# Altium schematic sheet EMMC.SchDoc
size A3; SheetNumber: 7; SheetTotal: 14
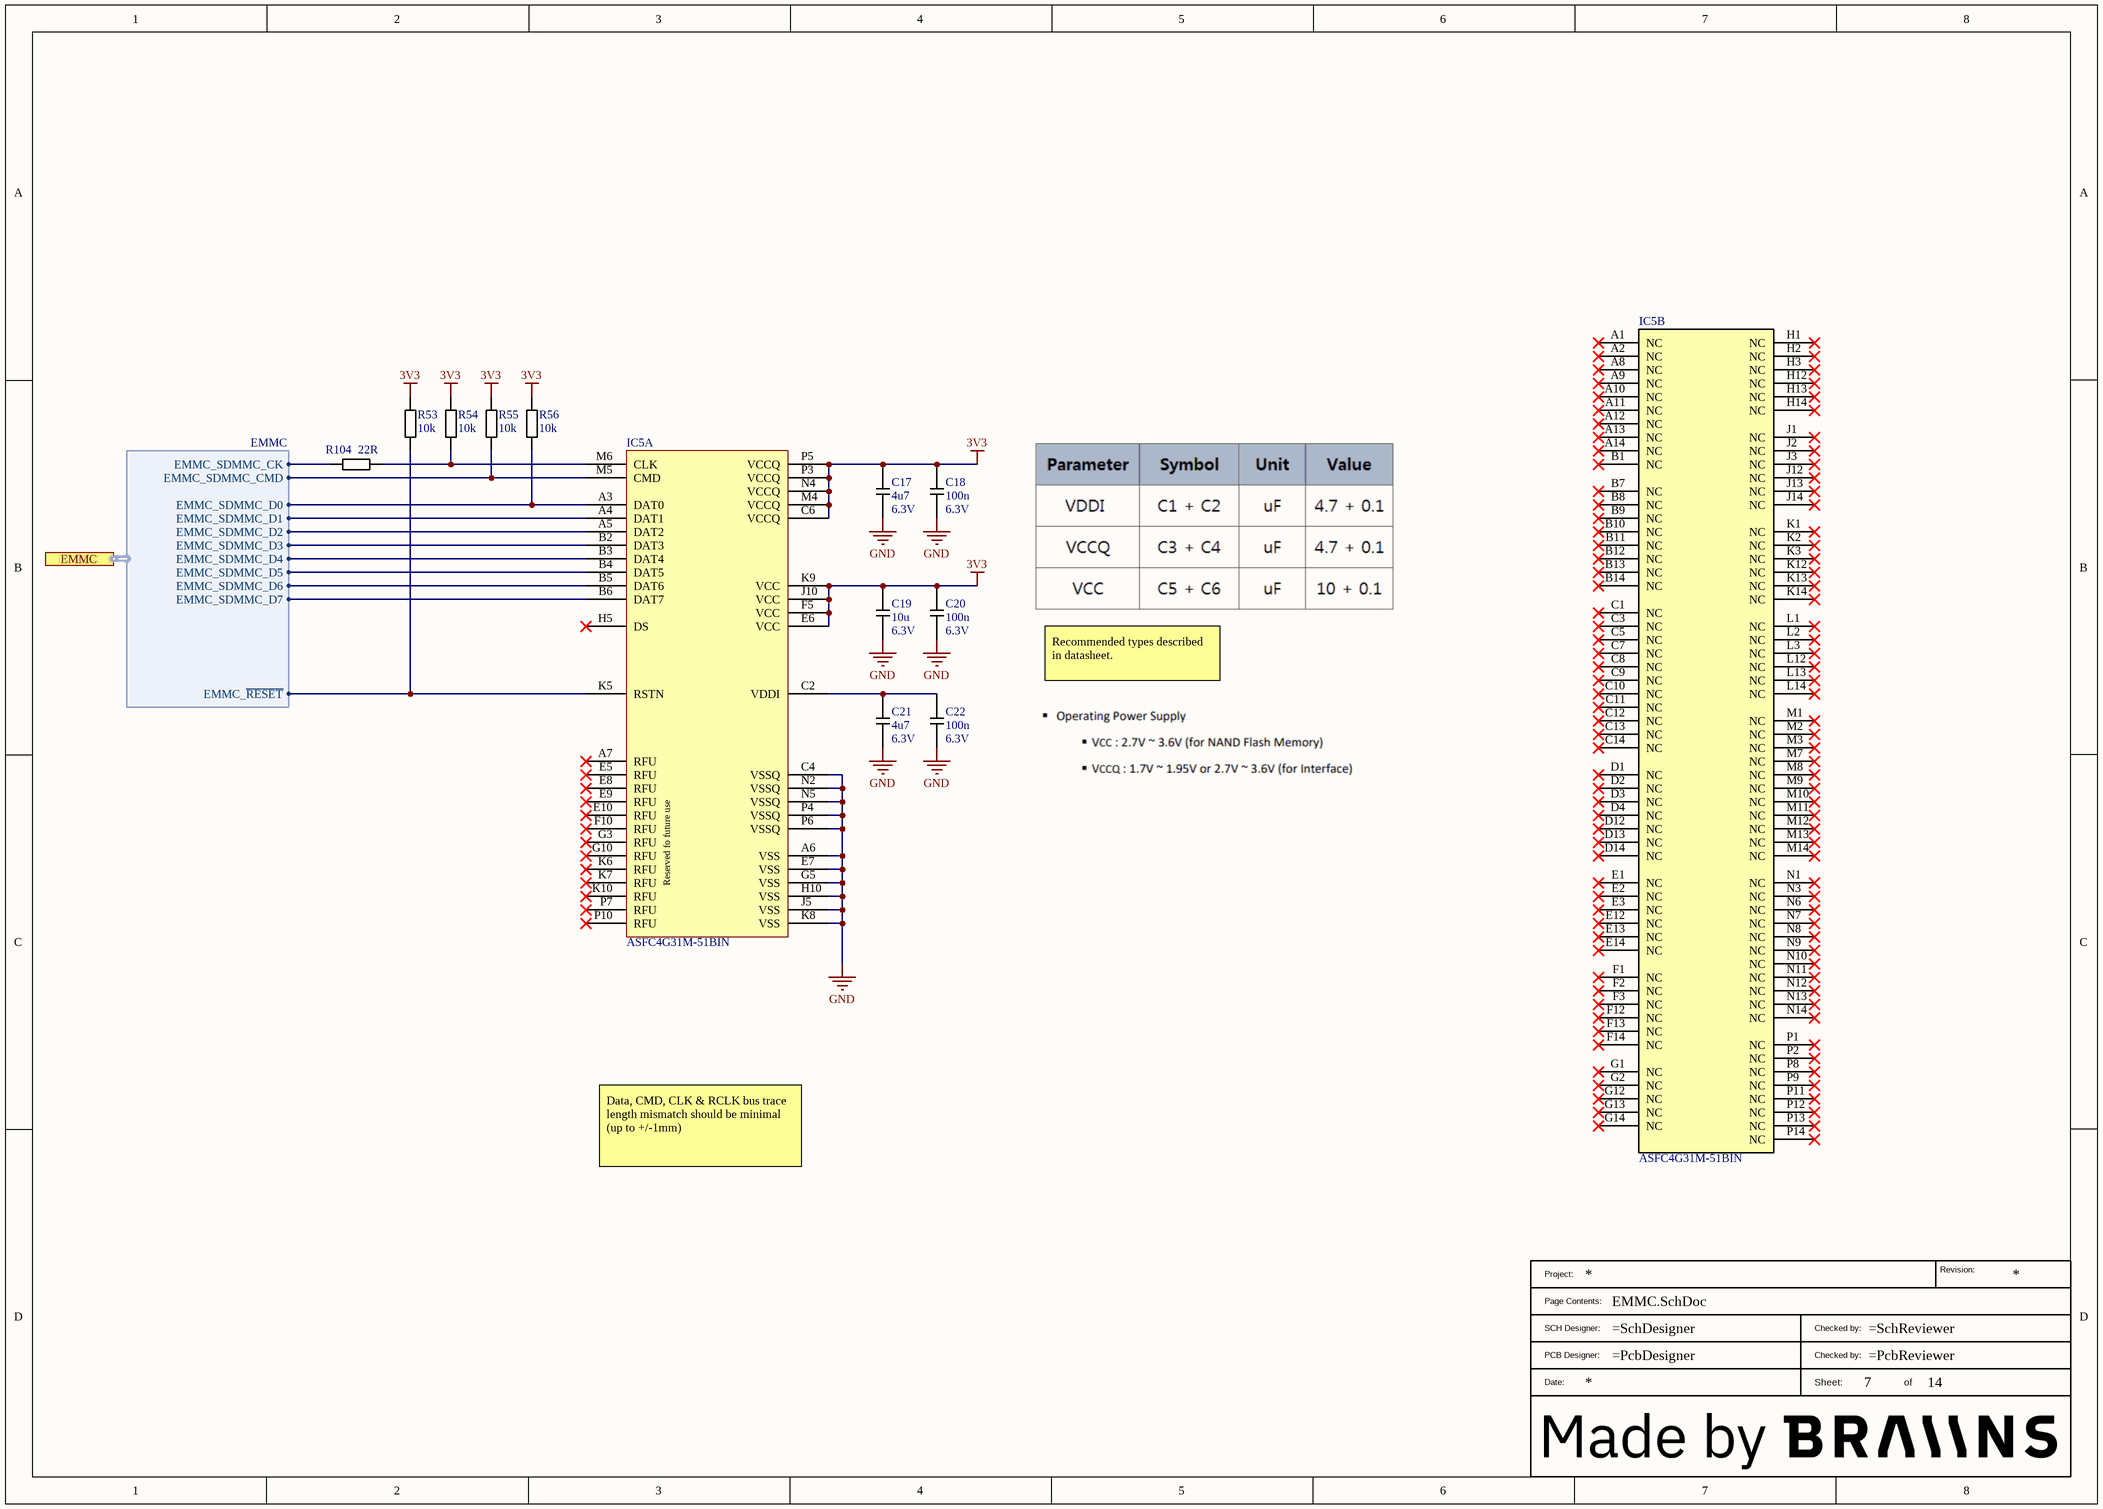
[diagram p0: EMMC.SchDoc]

## Parts
?  BraiinsTitleBlockWithLogo  (value not drawn)  (graphical)
C17  Voltage_Rating: 6.3V  [CAP0805]  (hidden comment: 4u7)
C18  Voltage_Rating: 6.3V  [CAP0603]  (hidden comment: 100n)
C19  Voltage_Rating: 6.3V  [CAP0805]  (hidden comment: 10u)
C20  Voltage_Rating: 6.3V  [CAP0603]  (hidden comment: 100n)
C21  Voltage_Rating: 6.3V  [CAP0805]  (hidden comment: 4u7)
C22  Voltage_Rating: 6.3V  [CAP0603]  (hidden comment: 100n)
IC5  ASFC4G31M-51BIN  [BGA153C50P14X14_1150X1300X100]  (parts A,B of 2)
R53  10k  [RES0402]
R54  10k  [RES0402]
R55  10k  [RES0402]
R56  10k  [RES0402]
R104  22R  [RES0402]

## Ports
EMMC (harness EMMC)

## Harnesses
EMMC: EMMC_SDMMC_CK, EMMC_SDMMC_CMD, EMMC_SDMMC_D0, EMMC_SDMMC_D1, EMMC_SDMMC_D2, EMMC_SDMMC_D3, EMMC_SDMMC_D4, EMMC_SDMMC_D5, EMMC_SDMMC_D6, EMMC_SDMMC_D7, EMMC_~{RESET}

## Nets
3V3: C17.1 C18.1 C19.1 C20.1 IC5.C6(VCCQ) IC5.E6(VCC) IC5.F5(VCC) IC5.J10(VCC) IC5.K9(VCC) IC5.M4(VCCQ) IC5.N4(VCCQ) IC5.P3(VCCQ) IC5.P5(VCCQ) R53.1 R54.1 R55.1 R56.1
GND: C17.2 C18.2 C19.2 C20.2 C21.2 C22.2 IC5.A6(VSS) IC5.C4(VSSQ) IC5.E7(VSS) IC5.G5(VSS) IC5.H10(VSS) IC5.J5(VSS) IC5.K8(VSS) IC5.N2(VSSQ) IC5.N5(VSSQ) IC5.P4(VSSQ) IC5.P6(VSSQ)
NetC21_1: C21.1 C22.1 IC5.C2(VDDI)
NetIC5_A3: IC5.A3(DAT0) R56.2 ; port EMMC.EMMC_SDMMC_D0
NetIC5_A4: IC5.A4(DAT1) ; port EMMC.EMMC_SDMMC_D1
NetIC5_A5: IC5.A5(DAT2) ; port EMMC.EMMC_SDMMC_D2
NetIC5_B2: IC5.B2(DAT3) ; port EMMC.EMMC_SDMMC_D3
NetIC5_B3: IC5.B3(DAT4) ; port EMMC.EMMC_SDMMC_D4
NetIC5_B4: IC5.B4(DAT5) ; port EMMC.EMMC_SDMMC_D5
NetIC5_B5: IC5.B5(DAT6) ; port EMMC.EMMC_SDMMC_D6
NetIC5_B6: IC5.B6(DAT7) ; port EMMC.EMMC_SDMMC_D7
NetIC5_K5: IC5.K5(RSTN) R53.2 ; port EMMC.EMMC_~{RESET}
NetIC5_M5: IC5.M5(CMD) R55.2 ; port EMMC.EMMC_SDMMC_CMD
NetIC5_M6: IC5.M6(CLK) R54.2 R104.2
NetR104_1: R104.1 ; port EMMC.EMMC_SDMMC_CK

Not connected (* = marked no-connect by the designer): IC5 A1(NC)* A2(NC)* A7(RFU)* A8(NC)* A9(NC)* A10(NC)* A11(NC)* A12(NC)* A13(NC)* A14(NC)* B1(NC)* B7(NC)* B8(NC)* B9(NC)* B10(NC)* B11(NC)* B12(NC)* B13(NC)* B14(NC)* C1(NC)* C3(NC)* C5(NC)* C7(NC)* C8(NC)* C9(NC)* C10(NC)* C11(NC)* C12(NC)* C13(NC)* C14(NC)* D1(NC)* D2(NC)* D3(NC)* D4(NC)* D12(NC)* D13(NC)* D14(NC)* E1(NC)* E2(NC)* E3(NC)* E5(RFU)* E8(RFU)* E9(RFU)* E10(RFU)* E12(NC)* E13(NC)* E14(NC)* F1(NC)* F2(NC)* F3(NC)* F10(RFU)* F12(NC)* F13(NC)* F14(NC)* G1(NC)* G2(NC)* G3(RFU)* G10(RFU)* G12(NC)* G13(NC)* G14(NC)* H1(NC)* H2(NC)* H3(NC)* H5(DS)* H12(NC)* H13(NC)* H14(NC)* J1(NC)* J2(NC)* J3(NC)* J12(NC)* J13(NC)* J14(NC)* K1(NC)* K2(NC)* K3(NC)* K6(RFU)* K7(RFU)* K10(RFU)* K12(NC)* K13(NC)* K14(NC)* L1(NC)* L2(NC)* L3(NC)* L12(NC)* L13(NC)* L14(NC)* M1(NC)* M2(NC)* M3(NC)* M7(NC)* M8(NC)* M9(NC)* M10(NC)* M11(NC)* M12(NC)* M13(NC)* M14(NC)* N1(NC)* N3(NC)* N6(NC)* N7(NC)* N8(NC)* N9(NC)* N10(NC)* N11(NC)* N12(NC)* N13(NC)* N14(NC)* P1(NC)* P2(NC)* P7(RFU)* P8(NC)* P9(NC)* P10(RFU)* P11(NC)* P12(NC)* P13(NC)* P14(NC)*

## Notes on the sheet
- Recommended types described in datasheet.
- Data, CMD, CLK & RCLK bus trace length mismatch should be minimal (up to +/-1mm)
- (in symbol 30134, part A) Reserved fo future use
- (in symbol BraiinsTitleBlockWithLogo) Revision:; Project:; Page Contents:; SCH Designer:; Checked by:; PCB Designer:; Date:; Sheet:; of

## Library data of the parts
C17 C21 = 30175: CAP CER 4u7 10% 6.3V X7R 0805; Part_Type: Capacitor; Part_Status: New; ID: 30175; Updated By: janjuranek; Sorted_Value: 4; Value: 4u7; Sub_Type: CER; Manufacturer Part Description: CAP CER 4u7 10% 6.3V X7R 0805; Package_Case: 0805; RoHS: Yes; Dielectric: X7R; Tolerance: 10%; Created By: janjuranek; Created_Date: 2023-05-09 02:30:59; Updated_Date: 2023-05-09 02:31:25; ComponentLink1Description: Datasheet; ComponentLink2Description: Supplier Part Details
C18 C20 C22 = 30140: CAP CER 100n 10% 6.3V X7R 0603; Part_Type: Capacitor; Part_Status: New; ID: 30140; Updated By: janjuranek; Sorted_Value: 100; Value: 100n; Sub_Type: CER; Manufacturer Part Description: CAP CER 100n 10% 6.3V X7R 0603; Package_Case: 0603; RoHS: Yes; Dielectric: X7R; Tolerance: 10%; Created By: janjuranek; Created_Date: 2023-04-12 21:44:35; Updated_Date: 2023-04-12 21:45:00; ComponentLink1Description: Datasheet; ComponentLink2Description: Supplier Part Details
C19 = 30174: CAP CER 10u 10% 6.3V X7R 0805; Part_Type: Capacitor; Part_Status: New; ID: 30174; Updated By: janjuranek; Sorted_Value: 10; Value: 10u; Sub_Type: CER; Manufacturer Part Description: CAP CER 10u 10% 6.3V X7R 0805; Package_Case: 0805; RoHS: Yes; Dielectric: X7R; Tolerance: 10%; Created By: janjuranek; Created_Date: 2023-05-09 02:18:46; Updated_Date: 2023-05-09 02:19:22; ComponentLink1Description: Datasheet; ComponentLink2Description: Supplier Part Details
IC5 = 30134: IC FLASH 4GB MMC 153FBGA; Manufacturer: Alliance Memory, Inc.; Part_Status: New; ID: 30134; Updated By: janjuranek; Value: ASFC4G31M-51BIN; Part_Type: IC; Manufacturer Part Number: ASFC4G31M-51BIN; Manufacturer Part Description: IC FLASH 4GB MMC 153FBGA; Supplier 1: Digi-Key; Supplier Part Number 1: 1450-ASFC4G31M-51BIN-ND; Package_Case: 153-VFBGA; RoHS: Yes; Temperature Range: -40C to +85C (TA); Created By: janjuranek; Created_Date: 2023-04-11 10:19:35; Updated_Date: 2023-05-19 16:28:37; ComponentLink1Description: Datasheet; ComponentLink2Description: Supplier Part Details; ComponentLink2URL: https://www.digikey.com/products/en?keywords=ASFC4G31M-51BIN
R53-R56 = 30071: RES 10k Ohm 1% 0402; Part_Status: New; ID: 30071; Updated By: Jan; Sorted_Value: 10000; Value: 10k; Part_Type: Resistor; Manufacturer Part Description: RES 10k Ohm 1% 0402; Package_Case: 0402; RoHS: Yes; Tolerance: 1%; Created By: Jan; Created_Date: 2023-03-02 13:13:56; Updated_Date: 2023-03-02 13:14:31; ComponentLink1Description: Datasheet; ComponentLink2Description: Supplier Part Details; Temperature Range: -40 to +150C
R104 = 30156: RES 22R Ohm 1% 0402; Part_Status: New; ID: 30156; Updated By: janjuranek; Sorted_Value: 22; Value: 22R; Part_Type: Resistor; Manufacturer Part Description: RES 22R Ohm 1% 0402; Package_Case: 0402; RoHS: Yes; Tolerance: 1%; Created By: janjuranek; Created_Date: 2023-05-01 19:29:39; Updated_Date: 2023-05-01 19:30:05; ComponentLink1Description: Datasheet; ComponentLink2Description: Supplier Part Details